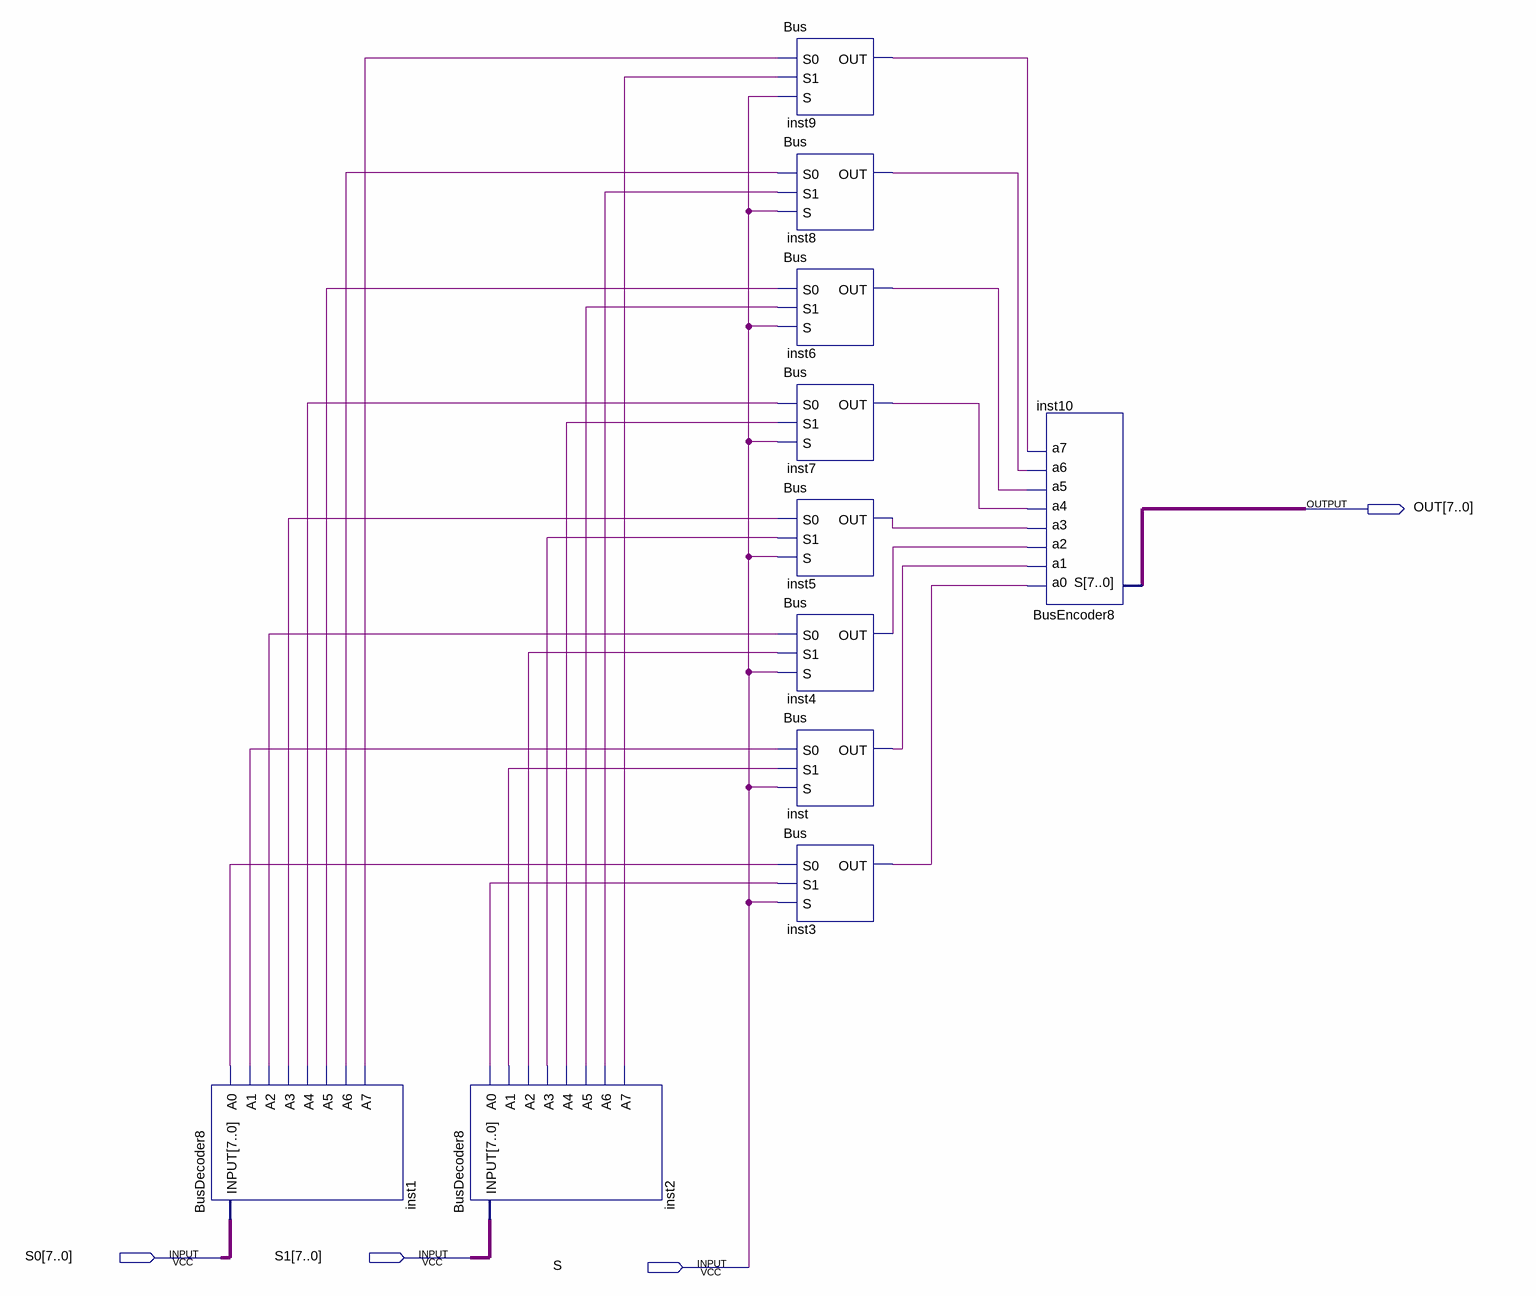
[diagram p0: schematic sheet]
// Quartus schematic BusMux.bdf as structural Verilog: 11 symbols, 4 pins
module BusMux (
  input  [7:0] S0,
  input  [7:0] S1,
  input  S,
  output [7:0] OUT
);

  wire inst1_a0, inst1_a1, inst1_a2, inst1_a3, inst1_a4, inst1_a5, inst1_a6, inst1_a7, inst2_a0, inst2_a1,
       inst2_a2, inst2_a3, inst2_a4, inst2_a5, inst2_a6, inst2_a7, inst3_out, inst4_out, inst5_out,
       inst6_out, inst7_out, inst8_out, inst9_out, inst_out;

  BusDecoder8 inst1 (
    .INPUT(S0), .A0(inst1_a0), .A1(inst1_a1), .A2(inst1_a2), .A3(inst1_a3), .A4(inst1_a4), .A5(inst1_a5),
    .A6(inst1_a6), .A7(inst1_a7));
  BusDecoder8 inst2 (
    .INPUT(S1), .A0(inst2_a0), .A1(inst2_a1), .A2(inst2_a2), .A3(inst2_a3), .A4(inst2_a4), .A5(inst2_a5),
    .A6(inst2_a6), .A7(inst2_a7));
  Bus inst9 (.S0(inst1_a7), .S1(inst2_a7), .S(S), .OUT(inst9_out));
  Bus inst8 (.S0(inst1_a6), .S1(inst2_a6), .S(S), .OUT(inst8_out));
  Bus inst6 (.S0(inst1_a5), .S1(inst2_a5), .S(S), .OUT(inst6_out));
  Bus inst7 (.S0(inst1_a4), .S1(inst2_a4), .S(S), .OUT(inst7_out));
  Bus inst5 (.S0(inst1_a3), .S1(inst2_a3), .S(S), .OUT(inst5_out));
  Bus inst4 (.S0(inst1_a2), .S1(inst2_a2), .S(S), .OUT(inst4_out));
  Bus inst (.S0(inst1_a1), .S1(inst2_a1), .S(S), .OUT(inst_out));
  Bus inst3 (.S0(inst1_a0), .S1(inst2_a0), .S(S), .OUT(inst3_out));
  BusEncoder8 inst10 (
    .a0(inst3_out), .a1(inst_out), .a2(inst4_out), .a3(inst5_out), .a4(inst7_out), .a5(inst6_out),
    .a6(inst8_out), .a7(inst9_out), .S(OUT));
endmodule
